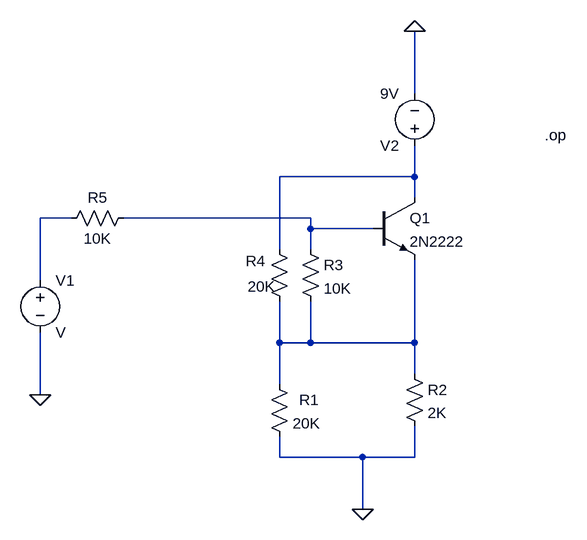
[diagram p0: schematic ques4.9.asc]
ques4.9.asc, the LTspice schematic file:
Version 4
SHEET 1 880 680
WIRE 400 0 400 -96
WIRE 400 128 400 80
WIRE 400 128 192 128
WIRE 400 160 400 128
WIRE -128 192 -176 192
WIRE 240 192 -48 192
WIRE 240 208 240 192
WIRE 336 208 240 208
WIRE 192 240 192 128
WIRE 240 240 240 208
WIRE -176 288 -176 192
WIRE 192 384 192 320
WIRE 240 384 240 320
WIRE 240 384 192 384
WIRE 400 384 400 256
WIRE 400 384 240 384
WIRE 400 432 400 384
WIRE 192 448 192 384
WIRE -176 464 -176 368
WIRE 192 560 192 528
WIRE 320 560 192 560
WIRE 400 560 400 512
WIRE 400 560 320 560
WIRE 320 640 320 560
FLAG -176 464 0
FLAG 320 640 0
FLAG 400 -96 0
SYMBOL npn 336 160 R0
SYMATTR InstName Q1
SYMATTR Value 2N2222
SYMBOL res 176 432 R0
WINDOW 0 46 40 Left 2
SYMATTR InstName R1
SYMATTR Value 20K
SYMBOL res 384 416 R0
SYMATTR InstName R2
SYMATTR Value 2K
SYMBOL res 224 224 R0
SYMATTR InstName R3
SYMATTR Value 10K
SYMBOL res 176 224 R0
WINDOW 0 -36 34 Left 2
WINDOW 3 -33 73 Left 2
SYMATTR InstName R4
SYMATTR Value 20K
SYMBOL res -32 176 R90
WINDOW 0 0 56 VBottom 2
WINDOW 3 32 56 VTop 2
SYMATTR InstName R5
SYMATTR Value 10K
SYMBOL voltage -176 272 R0
SYMATTR InstName V1
SYMBOL voltage 400 96 R180
WINDOW 123 0 0 Left 2
WINDOW 39 0 0 Left 2
SYMATTR InstName V2
SYMATTR Value 9V
TEXT 600 64 Left 2 !.op

The netlist it stands for:
* ques4.9.asc
Q1 N001 N003 N004 0 2N2222
R1 N004 0 20K
R2 N004 0 2K
R3 N003 N004 10K
R4 N001 N004 20K
R5 N003 N002 10K
V1 N002 0 V
V2 N001 0 9V
.model NPN NPN
.model PNP PNP
.lib standard.bjt
.op
.backanno
.end